# Altium schematic sheet Sheet2.SchDoc
size B; SheetNumber: 2; SheetTotal: 4
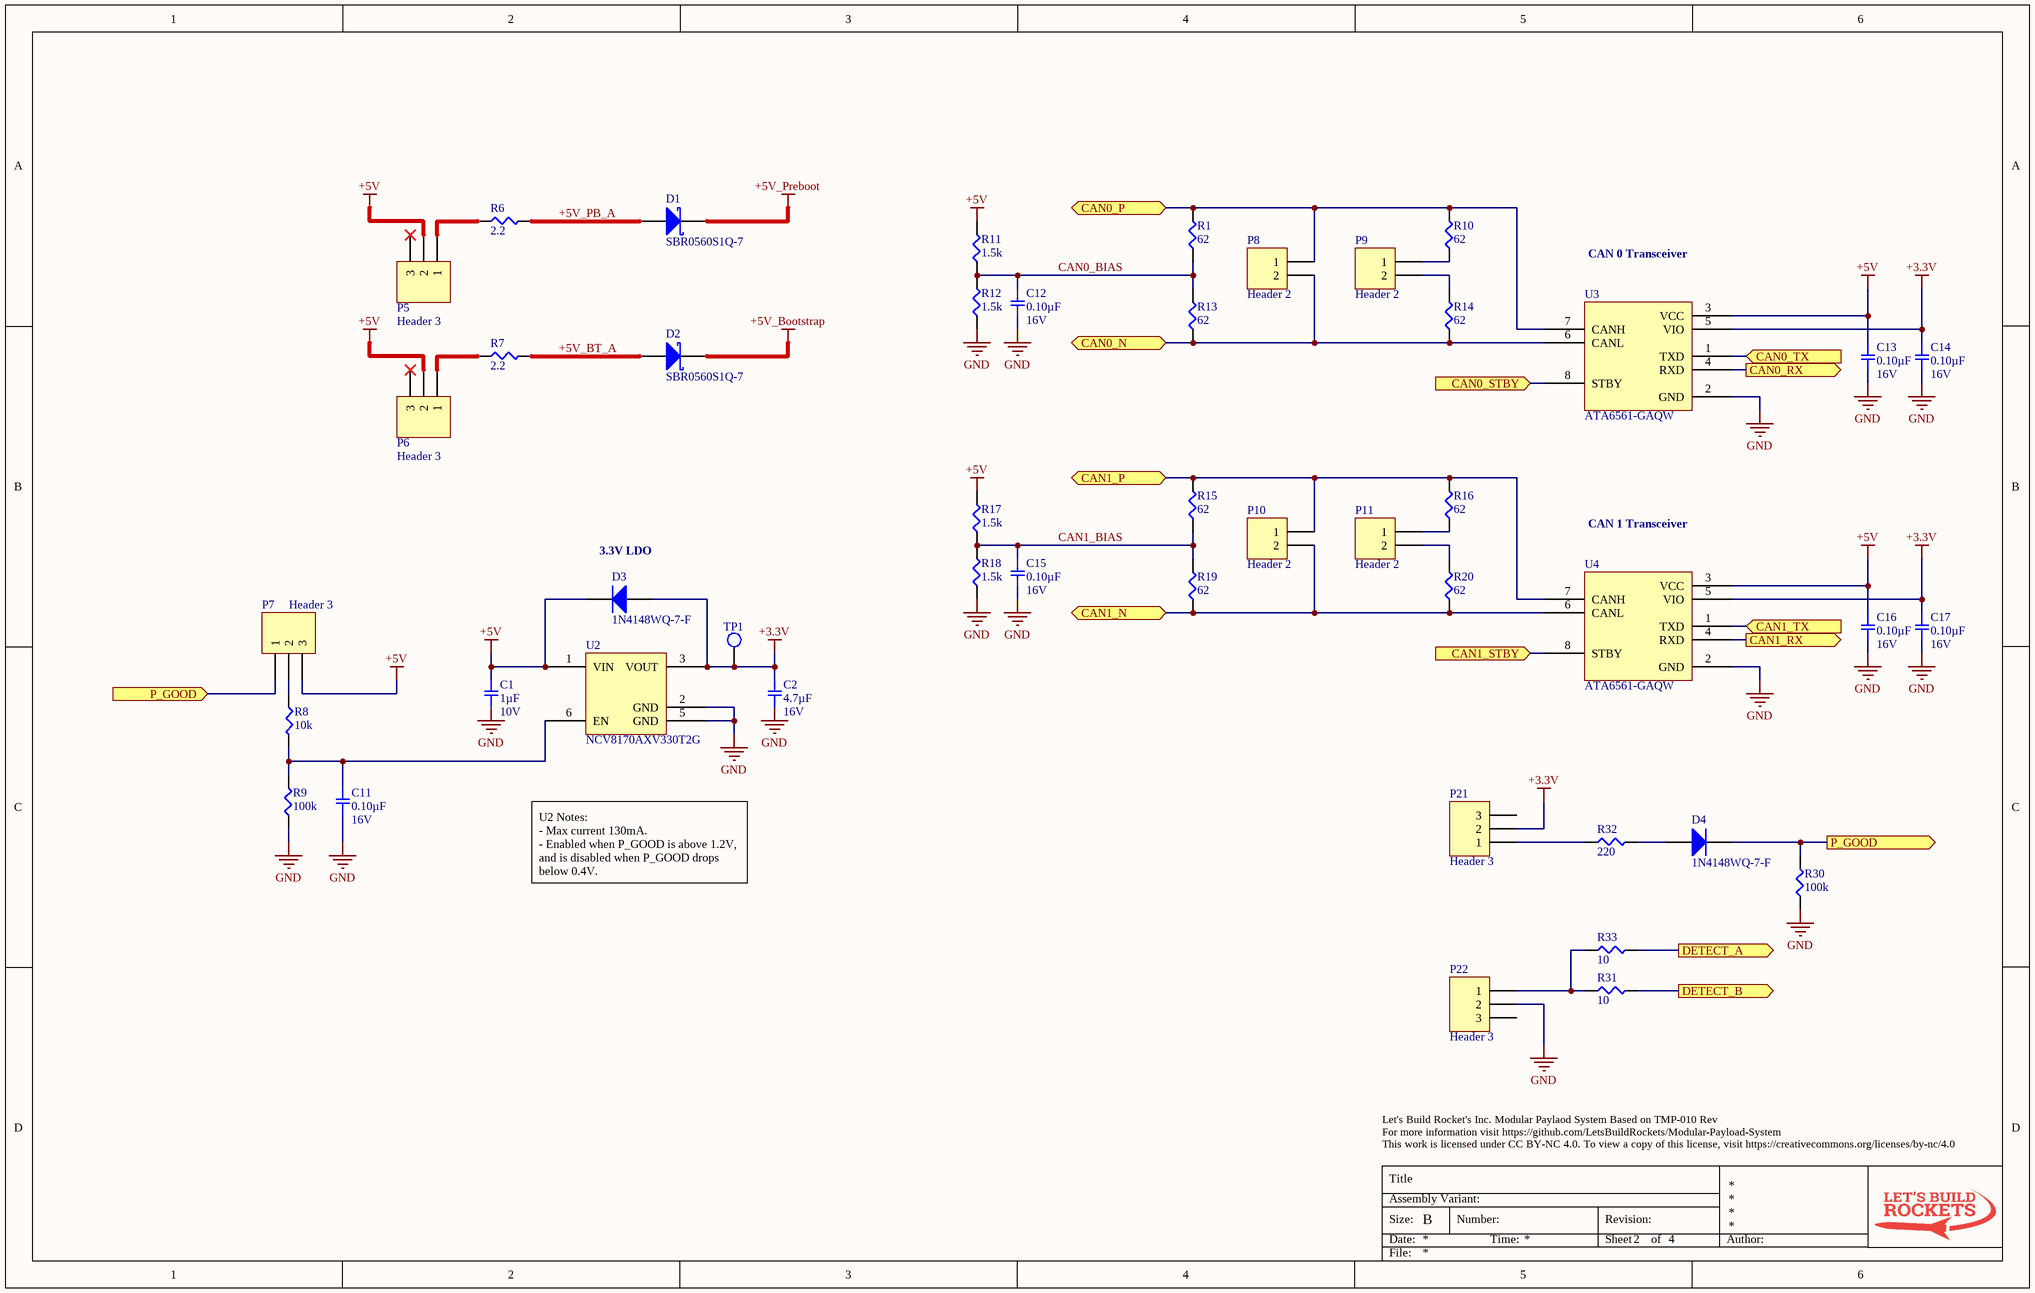
[diagram p0: Sheet2.SchDoc]

## Parts
C1  1µF  Voltage: 10V  [SMD-0402C]
C2  4.7µF  Voltage: 16V  [SMD-0805C]
C11  0.10µF  Voltage: 16V  [SMD-0402C]
C12  0.10µF  Voltage: 16V  [SMD-0402C]
C13  0.10µF  Voltage: 16V  [SMD-0402C]
C14  0.10µF  Voltage: 16V  [SMD-0402C]
C15  0.10µF  Voltage: 16V  [SMD-0402C]
C16  0.10µF  Voltage: 16V  [SMD-0402C]
C17  0.10µF  Voltage: 16V  [SMD-0402C]
D1  SBR0560S1Q-7  [SOD123]
D2  SBR0560S1Q-7  [SOD123]
D3  1N4148WQ-7-F  [SOD123]
D4  1N4148WQ-7-F  [SOD123]
P5  Header 3  [HDR1X3]  (no BOM)
P6  Header 3  [HDR1X3]  (no BOM)
P7  Header 3  [HDR1X3]  (no BOM)
P8  Header 2  [HDR1X2]  (no BOM)
P9  Header 2  [HDR1X2]  (no BOM)
P10  Header 2  [HDR1X2]  (no BOM)
P11  Header 2  [HDR1X2]  (no BOM)
P21  Header 3  [HDR1X3]  (no BOM)
P22  Header 3  [HDR1X3]  (no BOM)
R1  62  [SMD-0603-RES]
R6  2.2  [SMD-0805-RES]
R7  2.2  [SMD-0805-RES]
R8  10k  [SMD-0402-RES]
R9  100k  [SMD-0402-RES]
R10  62  [SMD-0603-RES]
R11  1.5k  [SMD-0402-RES]
R12  1.5k  [SMD-0402-RES]
R13  62  [SMD-0603-RES]
R14  62  [SMD-0603-RES]
R15  62  [SMD-0603-RES]
R16  62  [SMD-0603-RES]
R17  1.5k  [SMD-0402-RES]
R18  1.5k  [SMD-0402-RES]
R19  62  [SMD-0603-RES]
R20  62  [SMD-0603-RES]
R30  100k  [SMD-0402-RES]
R31  10  [SMD-0402-RES]
R32  220  [SMD-0402-RES]
R33  10  [SMD-0402-RES]
TP1  TP  [TP_SMD_40]  (value not drawn)  (no BOM)
U2  NCV8170AXV330T2G  [SOTFL50P160X60-6N]
U3  ATA6561-GAQW  [SOIC127P600X175-8N]
U4  ATA6561-GAQW  [SOIC127P600X175-8N]

## Ports
CAN0_N (bidir), CAN0_P (bidir), CAN0_RX (out), CAN0_STBY (in), CAN0_TX (in), CAN1_N (bidir), CAN1_P (bidir), CAN1_RX (out), CAN1_STBY (in), CAN1_TX (in), DETECT_A (out), DETECT_B (out), P_GOOD (in), P_GOOD (out)

## Nets
+3.3V: C2.2 C14.1 C17.1 D3.A P21.2 TP1.1 U2.3(VOUT) U3.5(VIO) U4.5(VIO)
+5V: C1.2 C13.1 C16.1 D3.K P5.2 P6.2 P7.3 R11.2 R17.2 U2.1(VIN) U3.3(VCC) U4.3(VCC)
+5V_Bootstrap: D2.K
+5V_Preboot: D1.K
GND: C1.1 C2.1 C11.1 C12.2 C13.2 C14.2 C15.2 C16.2 C17.2 P22.2 R9.1 R12.1 R18.1 R30.1 U2.2(GND) U2.5(GND) U3.2(GND) U4.2(GND)
+5V_BT_A: D2.A R7.2
+5V_PB_A: D1.A R6.2
CAN0_BIAS: C12.1 R1.1 R11.1 R12.2 R13.2
CAN0_N: P8.2 R13.1 R14.1 U3.6(CANL) ; port CAN0_N
CAN0_P: P8.1 R1.2 R10.2 U3.7(CANH) ; port CAN0_P
CAN0_RX: U3.4(RXD) ; port CAN0_RX
CAN0_STBY: U3.8(STBY) ; port CAN0_STBY
CAN0_TX: U3.1(TXD) ; port CAN0_TX
CAN1_BIAS: C15.1 R15.1 R17.1 R18.2 R19.2
CAN1_N: P10.2 R19.1 R20.1 U4.6(CANL) ; port CAN1_N
CAN1_P: P10.1 R15.2 R16.2 U4.7(CANH) ; port CAN1_P
CAN1_RX: U4.4(RXD) ; port CAN1_RX
CAN1_STBY: U4.8(STBY) ; port CAN1_STBY
CAN1_TX: U4.1(TXD) ; port CAN1_TX
DETECT_A: R33.2 ; port DETECT_A
DETECT_B: R31.2 ; port DETECT_B
P_GOOD: D4.K P7.1 R30.2 ; port P_GOOD
NetC11_2: C11.2 R8.2 R9.2 U2.6(EN)
NetD4_A: D4.A R32.2
NetP5_1: P5.1 R6.1
NetP6_1: P6.1 R7.1
NetP7_2: P7.2 R8.1
NetP9_1: P9.1 R10.1
NetP9_2: P9.2 R14.2
NetP11_1: P11.1 R16.1
NetP11_2: P11.2 R20.2
NetP21_1: P21.1 R32.1
NetP22_1: P22.1 R31.1 R33.1

Not connected (* = marked no-connect by the designer): P5 3*; P6 3*; P21 3; P22 3

## Notes on the sheet
- CAN 0 Transceiver
- (near D3) 3.3V LDO
- CAN 1 Transceiver
- U2 Notes:
  - Max current 130mA.
  - Enabled when P_GOOD is above 1.2V, and is disabled when P_GOOD drops below 0.4V.
- Let's Build Rocket's Inc. Modular Paylaod System Based on TMP-010 Rev
  For more information visit https://github.com/LetsBuildRockets/Modular-Payload-System
  This work is licensed under CC BY-NC 4.0. To view a copy of this license, visit https://creativecommons.org/licenses/by-nc/4.0
- Title
- Size:
- Date:
- Assembly Variant:
- B
- Number:
- Time:
- Revision:
- Sheet
- of
- Author:
- File:

## Library data of the parts
C1 = GCM155C71A105KE38D: CAP CER 1UF 10V X7S 0402; Manufacturer: Murata Electronics North America; Factory Stock: 0; Unit Price (USD): 0.12; Minimum Quantity: 1; Tolerance: ±10%; Datasheets: http://www.murata.com/~/media/webrenewal/support/library/catalog/products/capacitor/mlcc/c03e.ashx; Image: //media.digikey.com/Renders/Murata%20Renders/ZRB-SERIES-0402.jpg; Digi-Key Part Number: 490-13409-1-ND; Part Number: GCM155C71A105KE38D; Quantity Available: 7240; @ qty: 0; Packaging: Cut Tape (CT); Series: GCM; Part Status: Active; Value: 1µF; Temperature Coefficient: X7S; Operating Temperature: -55°C ~ 125°C; Features: -; Ratings: AEC-Q200; Applications: Automotive; Mounting Type: Surface Mount, MLCC; Package / Case: 0402 (1005 Metric); Size / Dimension: 0.039" L x 0.020" W (1.00mm x 0.50mm); Height - Seated (Max): -; Thickness (Max): 0.022" (0.55mm); Lead Spacing: -; Lead Style: -
C2 = GCJ21BR71C475KA01L: CAP CER 4.7UF 16V X7R 0805; Manufacturer: Murata Electronics North America; Factory Stock: 0; Unit Price (USD): 0.44; Minimum Quantity: 1; Tolerance: ±10%; Datasheets: http://www.murata.com/~/media/webrenewal/support/library/catalog/products/capacitor/mlcc/c03e.ashx; Image: //media.digikey.com/Renders/Murata%20Renders/0805%20(2012%20Metric)%20.85mm.jpg; Digi-Key Part Number: 490-10557-1-ND; Part Number: GCJ21BR71C475KA01L; Quantity Available: 53217; @ qty: 0; Packaging: Cut Tape (CT); Series: GCJ; Part Status: Active; Value: 4.7µF; Temperature Coefficient: X7R; Operating Temperature: -55°C ~ 125°C; Features: Soft Termination; Ratings: AEC-Q200; Applications: Automotive, Boardflex Sensitive; Mounting Type: Surface Mount, MLCC; Package / Case: 0805 (2012 Metric); Size / Dimension: 0.079" L x 0.049" W (2.00mm x 1.25mm); Height - Seated (Max): -; Thickness (Max): 0.057" (1.45mm); Lead Spacing: -; Lead Style: -
C11-C17 = GCM155R71C104KA55D: CAP CER 0.1UF 16V X7R 0402; Manufacturer: Murata Electronics North America; Factory Stock: 0; Unit Price (USD): 0.1; Minimum Quantity: 1; Tolerance: ±10%; Datasheets: http://www.murata.com/~/media/webrenewal/support/library/catalog/products/capacitor/mlcc/c03e.ashx; Image: //media.digikey.com/Renders/Murata%20Renders/ZRB-SERIES-0402.jpg; Digi-Key Part Number: 490-4759-1-ND; Part Number: GCM155R71C104KA55D; Quantity Available: 734194; @ qty: 0; Packaging: Cut Tape (CT); Series: GCM; Part Status: Active; Value: 0.10µF; Temperature Coefficient: X7R; Operating Temperature: -55°C ~ 125°C; Features: -; Ratings: AEC-Q200; Applications: Automotive; Mounting Type: Surface Mount, MLCC; Package / Case: 0402 (1005 Metric); Size / Dimension: 0.039" L x 0.020" W (1.00mm x 0.50mm); Height - Seated (Max): -; Thickness (Max): 0.022" (0.55mm); Lead Spacing: -; Lead Style: -
D1 D2 = SBR0560S1Q-7: Unit Price (USD): 0.37
D3 D4 = 1N4148WQ-7-F: Unit Price (USD): 0.19
P5-P7 P21 P22 = Header 3: Header, 3-Pin; LatestRevisionDate: 17-Jul-2002; LatestRevisionNote: Re-released for DXP Platform.; Publisher: Altium Limited
P8-P11 = Header 2: Header, 2-Pin; LatestRevisionDate: 17-Jul-2002; LatestRevisionNote: Re-released for DXP Platform.; Publisher: Altium Limited
R1 R10 R13-R16 R19 R20 = ERJ-PA3J620V: RES SMD 62 OHM 5% 1/4W 0603; Manufacturer: Panasonic Electronic Components; Factory Stock: 0; Unit Price (USD): 0.01646; @ qty: 1500; Minimum Quantity: 1; Power (Watts): 0.25W, 1/4W; Temperature Coefficient: ±200ppm/°C; Part Number: ERJ-PA3J620V; Datasheets: https://industrial.panasonic.com/cdbs/www-data/pdf/RDA0000/AOA0000C243.pdf; Image: //media.digikey.com/Photos/Panasonic%20Photos/MFG_ERJ-P6W%20Series.jpg; Digi-Key Part Number: P62.00BZCT-ND; Quantity Available: 2726; Packaging: Cut Tape (CT); Series: ERJ; Part Status: Active; Value: 62; Tolerance: ±5%; Composition: Thick Film; Features: Automotive AEC-Q200, Pulse Withstanding; Operating Temperature: -55°C ~ 155°C; Package / Case: 0603 (1608 Metric); Supplier Device Package: 0603; Size / Dimension: 0.063" L x 0.031" W (1.60mm x 0.80mm); Height - Seated (Max): 0.022" (0.55mm); Number of Terminations: 2; Failure Rate: -
R6 R7 = ERJ-6GEYJ2R2V: RES SMD 2.2 OHM 5% 1/8W 0805; Manufacturer: Panasonic Electronic Components; Factory Stock: 0; Unit Price (USD): 0.00496; @ qty: 1500; Minimum Quantity: 1; Power (Watts): 0.125W, 1/8W; Temperature Coefficient: -100/ +600ppm/°C; Part Number: ERJ-6GEYJ2R2V; Datasheets: http://industrial.panasonic.com/www-cgi/jvcr13pz.cgi?E+PZ+3+AOA0001+ERJ6GEYJ2R2V+7+WW; Image: //media.digikey.com/Renders/Panasonic%20Renders/ERJ-0805%20Pkg.jpg; Digi-Key Part Number: P2.2ACT-ND; Quantity Available: 74294; Packaging: Cut Tape (CT); Series: ERJ; Part Status: Active; Value: 2.2; Tolerance: ±5%; Composition: Thick Film; Features: Automotive AEC-Q200; Operating Temperature: -55°C ~ 155°C; Package / Case: 0805 (2012 Metric); Supplier Device Package: 0805; Size / Dimension: 0.079" L x 0.049" W (2.00mm x 1.25mm); Height - Seated (Max): 0.028" (0.70mm); Number of Terminations: 2; Failure Rate: -
R8 = ERJ-2GEJ103X: RES SMD 10K OHM 5% 1/10W 0402; Manufacturer: Panasonic Electronic Components; Factory Stock: 0; Unit Price (USD): 0.00350; @ qty: 1500; Minimum Quantity: 1; Power (Watts): 0.1W, 1/10W; Temperature Coefficient: ±200ppm/°C; Part Number: ERJ-2GEJ103X; Datasheets: http://industrial.panasonic.com/www-cgi/jvcr13pz.cgi?E+PZ+3+AOA0001+ERJ2GEJ103X+7+WW; Image: //media.digikey.com/Photos/Panasonic%20Photos/ERJ-PA2-Series.jpg; Digi-Key Part Number: P10KJCT-ND; Quantity Available: 2560215; Packaging: Cut Tape (CT); Series: ERJ; Part Status: Active; Value: 10k; Tolerance: ±5%; Composition: Thick Film; Features: Automotive AEC-Q200; Operating Temperature: -55°C ~ 155°C; Package / Case: 0402 (1005 Metric); Supplier Device Package: 0402; Size / Dimension: 0.039" L x 0.020" W (1.00mm x 0.50mm); Height - Seated (Max): 0.016" (0.40mm); Number of Terminations: 2; Failure Rate: -
R9 R30 = ERJ-2GEJ104X: RES SMD 100K OHM 5% 1/10W 0402; Manufacturer: Panasonic Electronic Components; Factory Stock: 0; Unit Price (USD): 0.00350; @ qty: 1500; Minimum Quantity: 1; Power (Watts): 0.1W, 1/10W; Temperature Coefficient: ±200ppm/°C; Part Number: ERJ-2GEJ104X; Datasheets: http://industrial.panasonic.com/www-cgi/jvcr13pz.cgi?E+PZ+3+AOA0001+ERJ2GEJ104X+7+WW; Image: //media.digikey.com/Photos/Panasonic%20Photos/ERJ-PA2-Series.jpg; Digi-Key Part Number: P100KJCT-ND; Quantity Available: 2387986; Packaging: Cut Tape (CT); Series: ERJ; Part Status: Active; Value: 100k; Tolerance: ±5%; Composition: Thick Film; Features: Automotive AEC-Q200; Operating Temperature: -55°C ~ 155°C; Package / Case: 0402 (1005 Metric); Supplier Device Package: 0402; Size / Dimension: 0.039" L x 0.020" W (1.00mm x 0.50mm); Height - Seated (Max): 0.016" (0.40mm); Number of Terminations: 2; Failure Rate: -
R11 R12 R17 R18 = ERJ-2RKF1501X: RES SMD 1.5K OHM 1% 1/10W 0402; Manufacturer: Panasonic Electronic Components; Factory Stock: 0; Unit Price (USD): 0.00496; @ qty: 1500; Minimum Quantity: 1; Power (Watts): 0.1W, 1/10W; Temperature Coefficient: ±100ppm/°C; Part Number: ERJ-2RKF1501X; Datasheets: http://industrial.panasonic.com/www-cgi/jvcr13pz.cgi?E+PZ+3+AOA0002+ERJ2RKF1501X+7+WW; Image: //media.digikey.com/Photos/Panasonic%20Photos/ERJ-PA2-Series.jpg; Digi-Key Part Number: P1.50KLCT-ND; Quantity Available: 462851; Packaging: Cut Tape (CT); Series: ERJ; Part Status: Active; Value: 1.5k; Tolerance: ±1%; Composition: Thick Film; Features: Automotive AEC-Q200; Operating Temperature: -55°C ~ 155°C; Package / Case: 0402 (1005 Metric); Supplier Device Package: 0402; Size / Dimension: 0.039" L x 0.020" W (1.00mm x 0.50mm); Height - Seated (Max): 0.016" (0.40mm); Number of Terminations: 2; Failure Rate: -
R31 R33 = ERJ-2GEJ100X: RES SMD 10 OHM 5% 1/10W 0402; Manufacturer: Panasonic Electronic Components; Factory Stock: 0; Unit Price (USD): 0.00350; @ qty: 1500; Minimum Quantity: 1; Power (Watts): 0.1W, 1/10W; Temperature Coefficient: ±200ppm/°C; Part Number: ERJ-2GEJ100X; Datasheets: http://industrial.panasonic.com/www-cgi/jvcr13pz.cgi?E+PZ+3+AOA0001+ERJ2GEJ100X+7+WW; Image: //media.digikey.com/Photos/Panasonic%20Photos/ERJ-PA2-Series.jpg; Digi-Key Part Number: P10JCT-ND; Quantity Available: 1054751; Packaging: Cut Tape (CT); Series: ERJ; Part Status: Active; Value: 10; Tolerance: ±5%; Composition: Thick Film; Features: Automotive AEC-Q200; Operating Temperature: -55°C ~ 155°C; Package / Case: 0402 (1005 Metric); Supplier Device Package: 0402; Size / Dimension: 0.039" L x 0.020" W (1.00mm x 0.50mm); Height - Seated (Max): 0.016" (0.40mm); Number of Terminations: 2; Failure Rate: -
R32 = ERJ-2GEJ221X: RES SMD 220 OHM 5% 1/10W 0402; Manufacturer: Panasonic Electronic Components; Factory Stock: 0; Unit Price (USD): 0.00350; @ qty: 1500; Minimum Quantity: 1; Power (Watts): 0.1W, 1/10W; Temperature Coefficient: ±200ppm/°C; Part Number: ERJ-2GEJ221X; Datasheets: http://industrial.panasonic.com/www-cgi/jvcr13pz.cgi?E+PZ+3+AOA0001+ERJ2GEJ221X+7+WW; Image: //media.digikey.com/Photos/Panasonic%20Photos/ERJ-PA2-Series.jpg; Digi-Key Part Number: P220JCT-ND; Quantity Available: 702646; Packaging: Cut Tape (CT); Series: ERJ; Part Status: Active; Value: 220; Tolerance: ±5%; Composition: Thick Film; Features: Automotive AEC-Q200; Operating Temperature: -55°C ~ 155°C; Package / Case: 0402 (1005 Metric); Supplier Device Package: 0402; Size / Dimension: 0.039" L x 0.020" W (1.00mm x 0.50mm); Height - Seated (Max): 0.016" (0.40mm); Number of Terminations: 2; Failure Rate: -
U2 = NCV8170AXV330T2G: Unit Price (USD): 0.44
U3 U4 = ATA6561-GAQW: Unit Price (USD): 0.53